# EAGLE schematic 2020can_master_v3 (EAGLE 9.6.2)
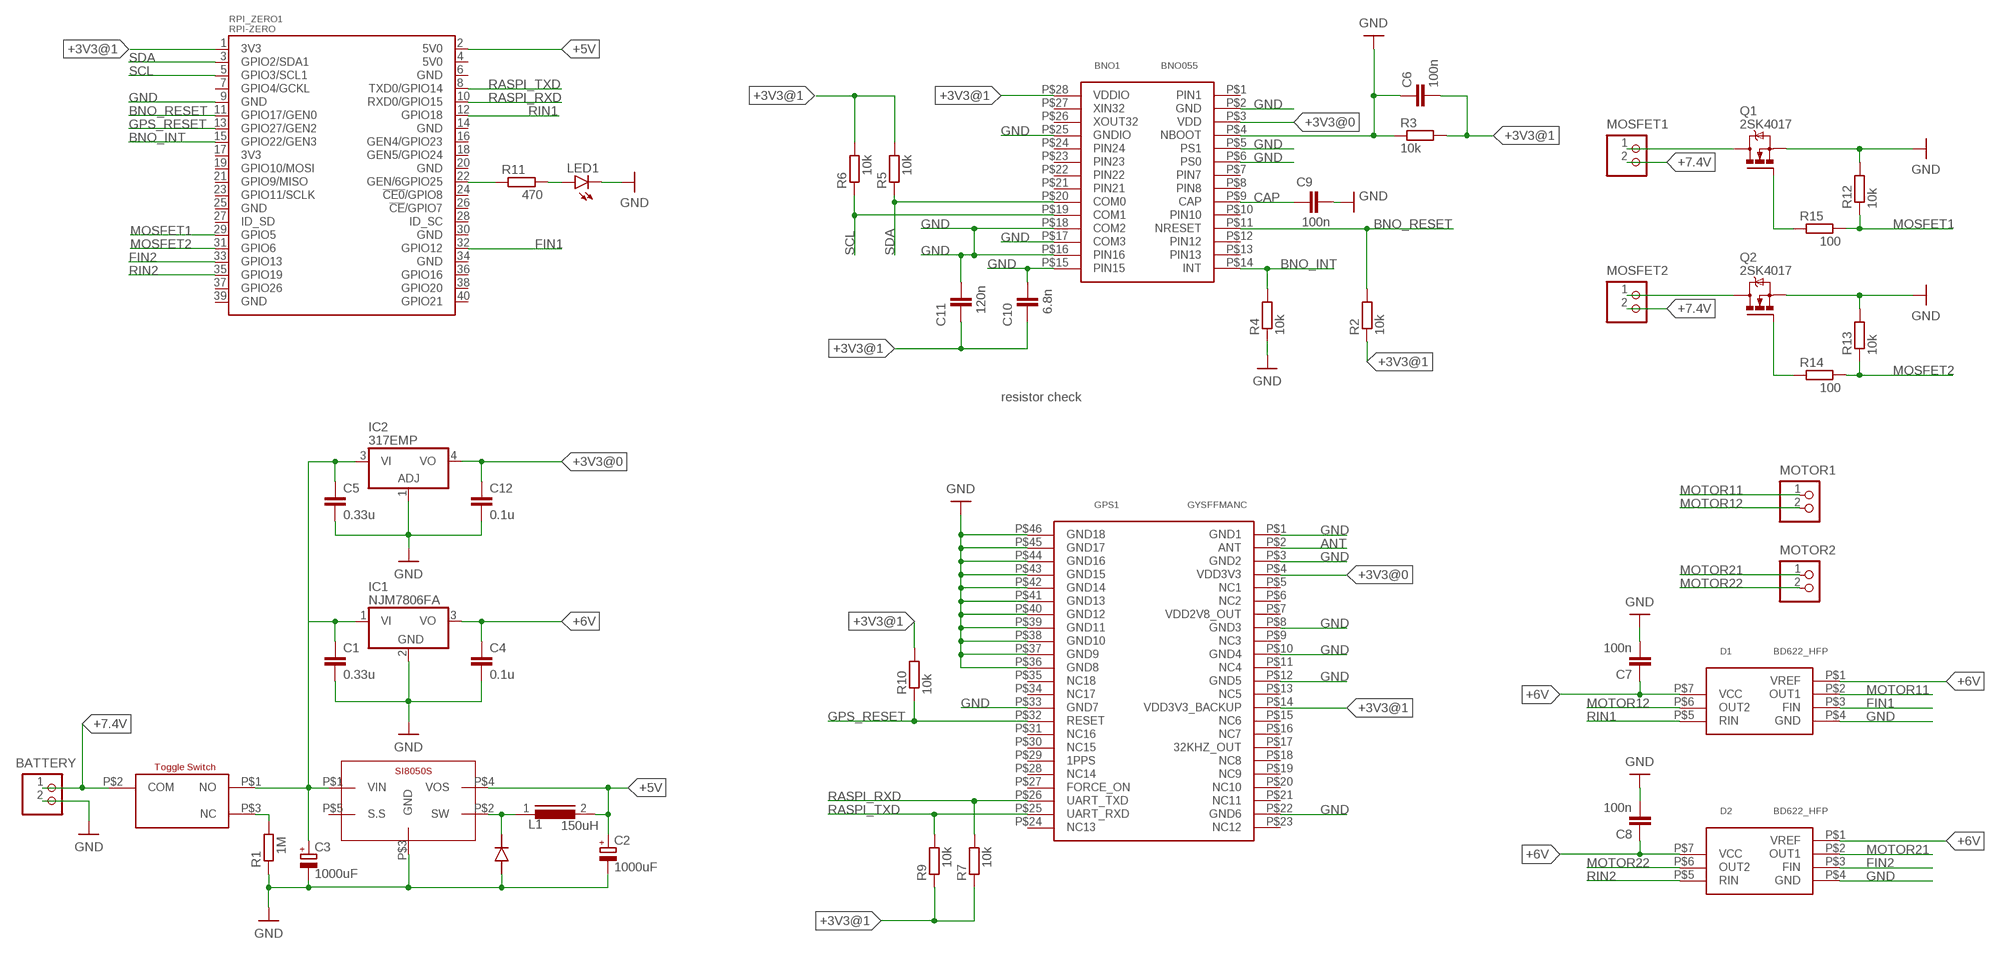
[diagram p0: schematic, sheet 1]

## Parts
BATTERY  B2P-VH  [B2P-VH]
BNO1  BNO055  [BNO055]
C1  0.33u  C5/3  [C5B3]
C2  1000uF  CPOL-EUE5-10.5  [E5-10,5]
C3  1000uF  CPOL-EUE5-10.5  [E5-10,5]
C4  0.1u  C5/3  [C5B3]
C5  0.33u  C5/3  [C5B3]
C6  100n  C-EUC1206  [C1206]
C7  100n  C-EUC1206  [C1206]
C8  100n  C-EUC1206  [C1206]
C9  100n  C-EUC1206  [C1206]
C10  6.8n  C-EUC1206  [C1206]
C11  120n  C-EUC1206  [C1206]
C12  0.1u  C5/3  [C5B3]
D1  BD622_HFP  [BD62**_HRP7]
D2  BD622_HFP  [BD62**_HRP7]
DIODE_1.1  DIODE_1.5  [DIODE_1.5]
GPS1  GYSFFMANC  [GYSFFMANC]
IC1  NJM7806FA  786TV  [TO220V]
IC2  317EMP  [SOT223]
L1  150uH  SFT830D  [SFT830D]
LED1  LED5MM  [LED5MM]
MOSFET1  B2P-VH  [B2P-VH]
MOSFET2  B2P-VH  [B2P-VH]
MOTOR1  B2P-VH  [B2P-VH]
MOTOR2  B2P-VH  [B2P-VH]
Q1  2SK4017  IRF520  [TO220BV]
Q2  2SK4017  IRF520  [TO220BV]
R1  1M  R-EU_R1206  [R1206]
R2  10k  R-EU_R1206  [R1206]
R3  10k  R-EU_R1206  [R1206]
R4  10k  R-EU_R1206  [R1206]
R5  10k  R-EU_R1206  [R1206]
R6  10k  R-EU_R1206  [R1206]
R7  10k  R-EU_R1206  [R1206]
R9  10k  R-EU_R1206  [R1206]
R10  10k  R-EU_R1206  [R1206]
R11  470  R-EU_0207/10  [0207/10]
R12  10k  R-EU_R1206  [R1206]
R13  10k  R-EU_R1206  [R1206]
R14  100  R-EU_0207/10  [0207/10]
R15  100  R-EU_0207/10  [0207/10]
RPI_ZERO1  RPI-ZERO  [RASP_PI_ZERO_BOARD_FULL]
SI8050S1  SI8050S  [SI8050S]
SWITCH_2MS1T2B4M2QES1  SWITCH_2MS1T2B4M2QES  [SWITCH_2MS1T2B4M2QES]

## Nets
+3V3@0: BNO1.P$3(VDD) C12.1 GPS1.P$4(VDD3V3) IC2.4(VO)
+3V3@1: BNO1.P$28(VDDIO) C6.2 C10.1 C11.1 GPS1.P$14(VDD3V3_BACKUP) R2.1 R3.2 R5.2 R6.2 R7.1 R9.1 R10.2 RPI_ZERO1.1(3V3)
+5V [power]: C2.+ L1.2 RPI_ZERO1.2(5V0) SI8050S1.P$4(VOS)
+6V [motor]: C4.1 C7.1 C8.1 D1.P$1(VREF) D1.P$7(VCC) D2.P$1(VREF) D2.P$7(VCC) IC1.3(VO)
+7.4V [power]: BATTERY.1 MOSFET1.2 MOSFET2.2 SWITCH_2MS1T2B4M2QES1.P$2(COM)
ANT [signal]: GPS1.P$2(ANT)
BNO_INT [signal]: BNO1.P$14(INT) R4.2 RPI_ZERO1.15(GPIO22/GEN3)
BNO_RESET [signal]: BNO1.P$11(NRESET) R2.2 RPI_ZERO1.11(GPIO17/GEN0)
CAP [signal]: BNO1.P$9(CAP) C9.1
FIN1 [signal]: D1.P$3(FIN) RPI_ZERO1.32(GPIO12)
FIN2 [signal]: D2.P$3(FIN) RPI_ZERO1.33(GPIO13)
GND: BATTERY.2 BNO1.P$2(GND) BNO1.P$4(NBOOT) BNO1.P$5(PS1) BNO1.P$6(PS0) BNO1.P$15(PIN15) BNO1.P$16(PIN16) BNO1.P$17(COM3) BNO1.P$18(COM2) BNO1.P$25(GNDIO) C1.2 C2.- C3.- C4.2 C5.2 C6.1 C7.2 C8.2 C9.2 C10.2 C11.2 C12.2 D1.P$4(GND) D2.P$4(GND) DIODE_1.1.P$1(ANODE) GPS1.P$1(GND1) GPS1.P$3(GND2) GPS1.P$8(GND3) GPS1.P$10(GND4) GPS1.P$12(GND5) GPS1.P$22(GND6) GPS1.P$33(GND7) GPS1.P$36(GND8) GPS1.P$37(GND9) GPS1.P$38(GND10) GPS1.P$39(GND11) GPS1.P$40(GND12) GPS1.P$41(GND13) GPS1.P$42(GND14) GPS1.P$43(GND15) GPS1.P$44(GND16) GPS1.P$45(GND17) GPS1.P$46(GND18) IC1.2(GND) IC2.1(ADJ) LED1.K(C) Q1.S Q2.S R1.1 R3.1 R4.1 R12.2 R13.2 RPI_ZERO1.9(GND) SI8050S1.P$3(GND)
GPS_RESET [signal]: GPS1.P$32(RESET) R10.1 RPI_ZERO1.13(GPIO27/GEN2)
MOSFET1 [mos]: R12.1 R15.2 RPI_ZERO1.29(GPIO5)
MOSFET2 [mos]: R13.1 R14.2 RPI_ZERO1.31(GPIO6)
MOTOR11 [motor]: D1.P$2(OUT1) MOTOR1.1
MOTOR12 [motor]: D1.P$6(OUT2) MOTOR1.2
MOTOR21 [motor]: D2.P$2(OUT1) MOTOR2.1
MOTOR22 [motor]: D2.P$6(OUT2) MOTOR2.2
N$1: R1.2 SWITCH_2MS1T2B4M2QES1.P$3(NC)
N$2 [motor]: DIODE_1.1.P$2(CATHODE) L1.1 SI8050S1.P$2(SW)
N$3 [signal]: R11.1 RPI_ZERO1.22(GEN/6GPIO25)
N$4 [power]: C1.1 C3.+ C5.1 IC1.1(VI) IC2.3(VI) SI8050S1.P$1(VIN) SWITCH_2MS1T2B4M2QES1.P$1(NO)
N$5 [signal]: LED1.A R11.2
N$6: MOSFET1.1 Q1.D
N$8: MOSFET2.1 Q2.D
N$10: Q1.G R15.1
N$11: Q2.G R14.1
RASPI_RXD [signal]: GPS1.P$26(UART_TXD) R7.2 RPI_ZERO1.10(RXD0/GPIO15)
RASPI_TXD [signal]: GPS1.P$25(UART_RXD) R9.2 RPI_ZERO1.8(TXD0/GPIO14)
RIN1 [signal]: D1.P$5(RIN) RPI_ZERO1.12(GPIO18)
RIN2 [signal]: D2.P$5(RIN) RPI_ZERO1.35(GPIO19)
SCL [signal]: BNO1.P$19(COM1) R6.1 RPI_ZERO1.5(GPIO3/SCL1)
SDA [signal]: BNO1.P$20(COM0) R5.1 RPI_ZERO1.3(GPIO2/SDA1)
Unconnected: BNO1.P$1(PIN1) BNO1.P$7(PIN7) BNO1.P$8(PIN8) BNO1.P$10(PIN10) BNO1.P$12(PIN12) BNO1.P$13(PIN13) BNO1.P$21(PIN21) BNO1.P$22(PIN22) BNO1.P$23(PIN23) BNO1.P$24(PIN24) BNO1.P$26(XOUT32) BNO1.P$27(XIN32) GPS1.P$5(NC1) GPS1.P$6(NC2) GPS1.P$7(VDD2V8_OUT) GPS1.P$9(NC3) GPS1.P$11(NC4) GPS1.P$13(NC5) GPS1.P$15(NC6) GPS1.P$16(NC7) GPS1.P$17(32KHZ_OUT) GPS1.P$18(NC8) GPS1.P$19(NC9) GPS1.P$20(NC10) GPS1.P$21(NC11) GPS1.P$23(NC12) GPS1.P$24(NC13) GPS1.P$27(FORCE_ON) GPS1.P$28(NC14) GPS1.P$29(1PPS) GPS1.P$30(NC15) GPS1.P$31(NC16) GPS1.P$34(NC17) GPS1.P$35(NC18) RPI_ZERO1.4(5V0) RPI_ZERO1.6(GND) RPI_ZERO1.7(GPIO4/GCKL) RPI_ZERO1.14(GND) RPI_ZERO1.16(GEN4/GPIO23) RPI_ZERO1.17(3V3) RPI_ZERO1.18(GEN5/GPIO24) RPI_ZERO1.19(GPIO10/MOSI) RPI_ZERO1.20(GND) RPI_ZERO1.21(GPIO9/MISO) RPI_ZERO1.23(GPIO11/SCLK) RPI_ZERO1.24(!CE0!/GPIO8) RPI_ZERO1.25(GND) RPI_ZERO1.26(!CE!/GPIO7) RPI_ZERO1.27(ID_SD) RPI_ZERO1.28(ID_SC) RPI_ZERO1.30(GND) RPI_ZERO1.34(GND) RPI_ZERO1.36(GPIO16) RPI_ZERO1.37(GPIO26) RPI_ZERO1.38(GPIO20) RPI_ZERO1.39(GND) RPI_ZERO1.40(GPIO21) SI8050S1.P$5(S.S)

## Notes on the sheet
- resistor check

## Library data of the parts
BATTERY MOSFET1 MOSFET2 MOTOR1 MOTOR2 = CONN_VH:B2P-VH: Wire-to-Board 3.96mm pitch top mount connector Source: http://www.jst-mfg.com/product/pdf/jpn/VH.pdf http://www.jst-mfg.com/product/detail.php?series=262
BNO1 = BNO055:BNO055
C1 C4 C5 C12 = capacitor-wima:C: CAPACITOR naming: grid - package width
C2 C3 = resistor:CPOL-EU: POLARIZED CAPACITOR, European symbol
C6-C11 = rcl:C-EU: CAPACITOR, European symbol; SPICEPREFIX: C
D1 D2 = BD62_:BD622*_HFP
DIODE_1.1 = diode_1.5mm:DIODE_1.5
GPS1 = GPS:GYSFFMANC
IC1 = linear:78*: Positive VOLTAGE REGULATOR Source: http://cache.national.com/ds/LM/LM78L05.pdf http://www.fairchildsemi.com/ds/LM/LM7805.pdf
IC2 = linear:*317: Positive VOLTAGE REGULATOR
L1 = inductors:SFT830D: INDUCTOR; SPICEPREFIX: L
LED1 = led:LED: LED OSRAM: - CHIPLED LG R971, LG N971, LY N971, LG Q971, LY Q971, LO R971, LY R971 LH N974, LH R974 LS Q976, LO Q976, LY Q976 LO Q996 - Hyper CHIPLED LW Q18S LB Q993, LB Q99A, LB R99A - SideLED LS A670, LO A670, LY A670, LG A670, LP A670 LB A673, LV A673, LT A673, LW A673 LH A674 LY A675 LS A676, LA A676, LO A676, LY A676, LW A676 LS A679, LY A679, LG A679 - Hyper Micro SIDELED® LS Y876, LA Y876, LO Y876, LY Y876 LT Y87S - SmartLED LW L88C, LW L88S LB L89C, LB L89S, LG L890 LS L89K, LO L89K, LY L89K LS L896, LA L896, LO L896, LY L896 - TOPLED LS T670, LO T670, LY T670, LG T670, LP T670 LSG T670, LSP T670, LSY T670, LOP T670, LYG T670 LG T671, LOG T671, LSG T671 LB T673, LV T673, LT T673, LW T673 LH T674 LS T676, LA T676, LO T676, LY T676, LB T676, LH T676, LSB T676, LW T676 LB T67C, LV T67C, LT T67C, LS T67K, LO T67K, LY T67K, LW E67C LS E67B, LA E67B, LO E67B, LY E67B, LB E67C, LV E67C, LT E67C LW T67C LS T679, LY T679, LG T679 LS T770, LO T770, LY T770, LG T770, LP T770 LB T773, LV T773, LT T773, LW T773 LH T774 LS E675, LA E675, LY E675, LS T675 LS T776, LA T776, LO T776, LY T776, LB T776 LHGB T686 LT T68C, LB T68C - Hyper Mini TOPLED® LB M676 - Mini TOPLED Santana® LG M470 LS M47K, LO M47K, LY M47K Source: http://www.osram.convergy.de LUXEON: - LUMILED® LXK2-PW12-R00, LXK2-PW12-S00, LXK2-PW14-U00, LXK2-PW14-V00 LXK2-PM12-R00, LXK2-PM12-S00, LXK2-PM14-U00 LXK2-PE12-Q00, LXK2-PE12-R00, LXK2-PE12-S00, LXK2-PE14-T00, LXK2-PE14-U00 LXK2-PB12-K00, LXK2-PB12-L00, LXK2-PB12-M00, LXK2-PB14-N00, LXK2-PB14-P00, LXK2-PB14-Q00 LXK2-PR12-L00, LXK2-PR12-M00, LXK2-PR14-Q00, LXK2-PR14-R00 LXK2-PD12-Q00, LXK2-PD12-R00, LXK2-PD12-S00 LXK2-PH12-R00, LXK2-PH12-S00 LXK2-PL12-P00, LXK2-PL12-Q00, LXK2-PL12-R00 Source: www.luxeon.com KINGBRIGHT: KA-3528ASYC Source: www.kingbright.com
Q1 Q2 = transistor-power:IRF520: HEXFET Power MOSFET
R1-R7 R9-R15 = rcl:R-EU_: RESISTOR, European symbol; SPICEPREFIX: R
RPI_ZERO1 = RaspberryPi_Zero:RPI-ZERO: MICON
SI8050S1 = SI-8050S:SI8050S
SWITCH_2MS1T2B4M2QES1 = switch_2MS1T2B4M2QES:SWITCH_2MS1T2B4M2QES

## Net classes
0 default: width 0.2 mm, clearance 0.05 mm
1 power: width 1.5 mm, clearance 0.2 mm
2 mos: width 1.5 mm, clearance 0.2 mm
3 signal: width 0.2 mm, clearance 0.05 mm
4 motor: width 0.8 mm, clearance 0.1 mm